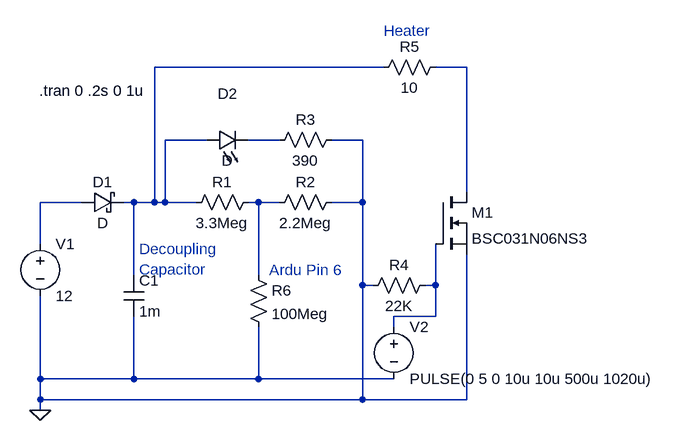
[diagram p0: schematic LTSpice_Heater_old.asc]
LTSpice_Heater_old.asc, the LTspice schematic file:
Version 4
SHEET 1 880 680
WIRE 400 -96 48 -96
WIRE 528 -96 480 -96
WIRE 128 16 64 16
WIRE 240 16 192 16
WIRE 368 16 320 16
WIRE 528 96 528 -96
WIRE -64 112 -128 112
WIRE 16 112 0 112
WIRE 48 112 48 -96
WIRE 48 112 16 112
WIRE 64 112 64 16
WIRE 64 112 48 112
WIRE 112 112 64 112
WIRE 208 112 192 112
WIRE 240 112 208 112
WIRE 368 112 368 16
WIRE 368 112 320 112
WIRE -128 176 -128 112
WIRE 16 224 16 112
WIRE 208 224 208 112
WIRE 368 240 368 112
WIRE 384 240 368 240
WIRE 480 240 480 176
WIRE 480 240 464 240
WIRE 480 288 480 240
WIRE 480 288 416 288
WIRE 416 304 416 288
WIRE -128 384 -128 256
WIRE 16 384 16 288
WIRE 16 384 -128 384
WIRE 208 384 208 304
WIRE 208 384 16 384
WIRE 416 384 208 384
WIRE -128 416 -128 384
WIRE 368 416 368 240
WIRE 368 416 -128 416
WIRE 528 416 528 192
WIRE 528 416 368 416
WIRE -128 432 -128 416
FLAG -128 432 0
SYMBOL voltage -128 160 R0
WINDOW 123 0 0 Left 2
WINDOW 39 0 0 Left 2
SYMATTR InstName V1
SYMATTR Value 12
SYMBOL res 96 128 R270
WINDOW 0 32 56 VTop 2
WINDOW 3 0 56 VBottom 2
SYMATTR InstName R1
SYMATTR Value 3.3Meg
SYMBOL res 224 128 R270
WINDOW 0 32 56 VTop 2
WINDOW 3 0 56 VBottom 2
SYMATTR InstName R2
SYMATTR Value 2.2Meg
SYMBOL res 224 32 R270
WINDOW 0 32 56 VTop 2
WINDOW 3 0 56 VBottom 2
SYMATTR InstName R3
SYMATTR Value 390
SYMBOL LED 128 32 R270
WINDOW 0 72 32 VTop 2
WINDOW 3 0 32 VBottom 2
SYMATTR InstName D2
SYMBOL nmos 480 96 R0
SYMATTR InstName M1
SYMATTR Value BSC031N06NS3
SYMBOL voltage 416 288 R0
WINDOW 123 0 0 Left 2
WINDOW 39 0 0 Left 2
SYMATTR InstName V2
SYMATTR Value PULSE(0 5 0 10u 10u 500u 1020u)
SYMBOL res 368 256 R270
WINDOW 0 32 56 VTop 2
WINDOW 3 0 56 VBottom 2
SYMATTR InstName R4
SYMATTR Value 22K
SYMBOL res 384 -80 R270
WINDOW 0 32 56 VTop 2
WINDOW 3 0 56 VBottom 2
SYMATTR InstName R5
SYMATTR Value 10
SYMBOL schottky -64 128 R270
WINDOW 0 32 32 VTop 2
WINDOW 3 0 32 VBottom 2
SYMATTR InstName D1
SYMBOL cap 0 224 R0
SYMATTR InstName C1
SYMATTR Value 1m
SYMBOL res 192 208 R0
SYMATTR InstName R6
SYMATTR Value 100Meg
TEXT -130 -60 Left 2 !.tran 0 .2s 0 1u
TEXT 400 -152 Left 2 ;Heater
TEXT 224 216 Left 2 ;Ardu Pin 6
TEXT 24 184 Left 2 ;Decoupling\nCapacitor

The netlist it stands for:
* LTSpice_Heater_old.asc
V1 N004 0 12
R1 N001 N005 3.3Meg
R2 N005 0 2.2Meg
R3 N003 0 390
D2 N001 N003 D
M1 N002 N006 0 0 BSC031N06NS3
V2 N006 0 PULSE(0 5 0 10u 10u 500u 1020u)
R4 0 N006 22K
R5 N001 N002 10
D1 N004 N001 D
C1 N001 0 1m
R6 N005 0 100Meg
.model D D
.lib standard.dio
.model NMOS NMOS
.model PMOS PMOS
.lib standard.mos
.tran 0 .2s 0 1u
* Heater
* Ardu Pin 6
* Decoupling
* Capacitor
.backanno
.end